# EAGLE design FireFly (EAGLE 9.5.2)
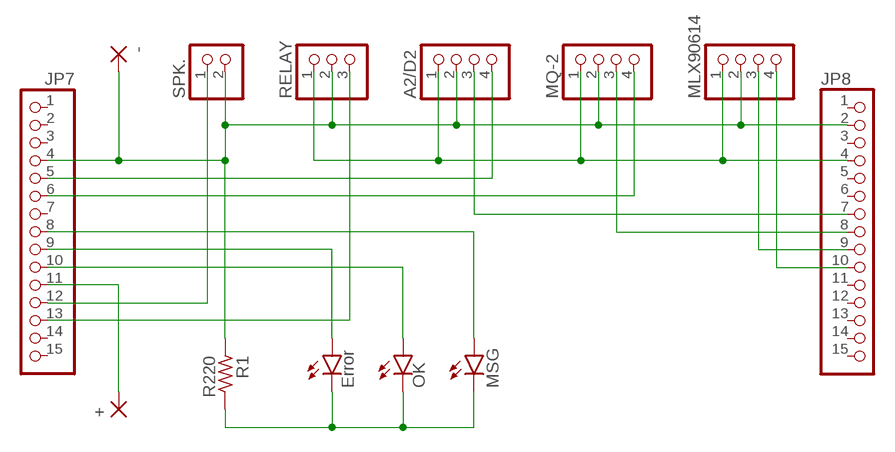
[diagram p0: schematic, sheet 1]

## Parts
+  WIREPADSMD1,27-254  [SMD1,27-2,54]
-  WIREPADSMD1,27-254  [SMD1,27-2,54]
A2/D2  PINHD-1X4  [1X04]
JP7  PINHD-1X15  [1X15]
JP8  PINHD-1X15  [1X15]
LED2  OK  LEDCHIPLED_0603  [CHIPLED_0603]
LED3  Error  LEDCHIPLED_0603  [CHIPLED_0603]
MLX90614  PINHD-1X4  [1X04]
MQ-2  PINHD-1X4  [1X04]
MSG  LEDCHIPLED_0603  [CHIPLED_0603]
R1  R220  R_0603  [R0603]
RELAY  PINHD-1X3  [1X03]
SPK.  PINHD-1X2  [1X02]

## Nets
N$1: JP8.10 MLX90614.4
N$2: JP8.9 MLX90614.3
N$3: JP8.8 MQ-2.3
N$4: JP7.6 MQ-2.4
N$5: A2/D2.3 JP8.7
N$6: -.1(P) A2/D2.2 JP7.4 JP8.2 MLX90614.2 MQ-2.2 R1.1 RELAY.2 SPK..2
N$7: A2/D2.4 JP7.5
N$8: JP7.13 RELAY.3
N$9: JP7.12 SPK..1
N$10: +.1(P) JP7.11
N$11: JP7.10 LED2.A
N$12: JP7.9 LED3.A
N$13: JP7.8 MSG.A
N$14: LED2.C LED3.C MSG.C R1.2
N$15: A2/D2.1 JP8.4 MLX90614.1 MQ-2.1 RELAY.1
Unconnected: JP7.1 JP7.2 JP7.3 JP7.7 JP7.14 JP7.15 JP8.1 JP8.3 JP8.5 JP8.6 JP8.11 JP8.12 JP8.13 JP8.14 JP8.15

## Library data of the parts
+ - = wirepad:WIREPAD: Wire PAD connect wire on PCB
A2/D2 MLX90614 MQ-2 = pinhead:PINHD-1X4: PIN HEADER
JP7 JP8 = pinhead:PINHD-1X15: PIN HEADER
LED2 LED3 MSG = led:LED: LED OSRAM: - CHIPLED LG R971, LG N971, LY N971, LG Q971, LY Q971, LO R971, LY R971 LH N974, LH R974 LS Q976, LO Q976, LY Q976 LO Q996 - Hyper CHIPLED LW Q18S LB Q993, LB Q99A, LB R99A - SideLED LS A670, LO A670, LY A670, LG A670, LP A670 LB A673, LV A673, LT A673, LW A673 LH A674 LY A675 LS A676, LA A676, LO A676, LY A676, LW A676 LS A679, LY A679, LG A679 - Hyper Micro SIDELED® LS Y876, LA Y876, LO Y876, LY Y876 LT Y87S - SmartLED LW L88C, LW L88S LB L89C, LB L89S, LG L890 LS L89K, LO L89K, LY L89K LS L896, LA L896, LO L896, LY L896 - TOPLED LS T670, LO T670, LY T670, LG T670, LP T670 LSG T670, LSP T670, LSY T670, LOP T670, LYG T670 LG T671, LOG T671, LSG T671 LB T673, LV T673, LT T673, LW T673 LH T674 LS T676, LA T676, LO T676, LY T676, LB T676, LH T676, LSB T676, LW T676 LB T67C, LV T67C, LT T67C, LS T67K, LO T67K, LY T67K, LW E67C LS E67B, LA E67B, LO E67B, LY E67B, LB E67C, LV E67C, LT E67C LW T67C LS T679, LY T679, LG T679 LS T770, LO T770, LY T770, LG T770, LP T770 LB T773, LV T773, LT T773, LW T773 LH T774 LS E675, LA E675, LY E675, LS T675 LS T776, LA T776, LO T776, LY T776, LB T776 LHGB T686 LT T68C, LB T68C - Hyper Mini TOPLED® LB M676 - Mini TOPLED Santana® LG M470 LS M47K, LO M47K, LY M47K Source: http://www.osram.convergy.de LUXEON: - LUMILED® LXK2-PW12-R00, LXK2-PW12-S00, LXK2-PW14-U00, LXK2-PW14-V00 LXK2-PM12-R00, LXK2-PM12-S00, LXK2-PM14-U00 LXK2-PE12-Q00, LXK2-PE12-R00, LXK2-PE12-S00, LXK2-PE14-T00, LXK2-PE14-U00 LXK2-PB12-K00, LXK2-PB12-L00, LXK2-PB12-M00, LXK2-PB14-N00, LXK2-PB14-P00, LXK2-PB14-Q00 LXK2-PR12-L00, LXK2-PR12-M00, LXK2-PR14-Q00, LXK2-PR14-R00 LXK2-PD12-Q00, LXK2-PD12-R00, LXK2-PD12-S00 LXK2-PH12-R00, LXK2-PH12-S00 LXK2-PL12-P00, LXK2-PL12-Q00, LXK2-PL12-R00 Source: www.luxeon.com KINGBRIGHT: KA-3528ASYC Source: www.kingbright.com
R1 = rc-master-smd:R_: RESISTOR
RELAY = pinhead:PINHD-1X3: PIN HEADER
SPK. = pinhead:PINHD-1X2: PIN HEADER

## Board
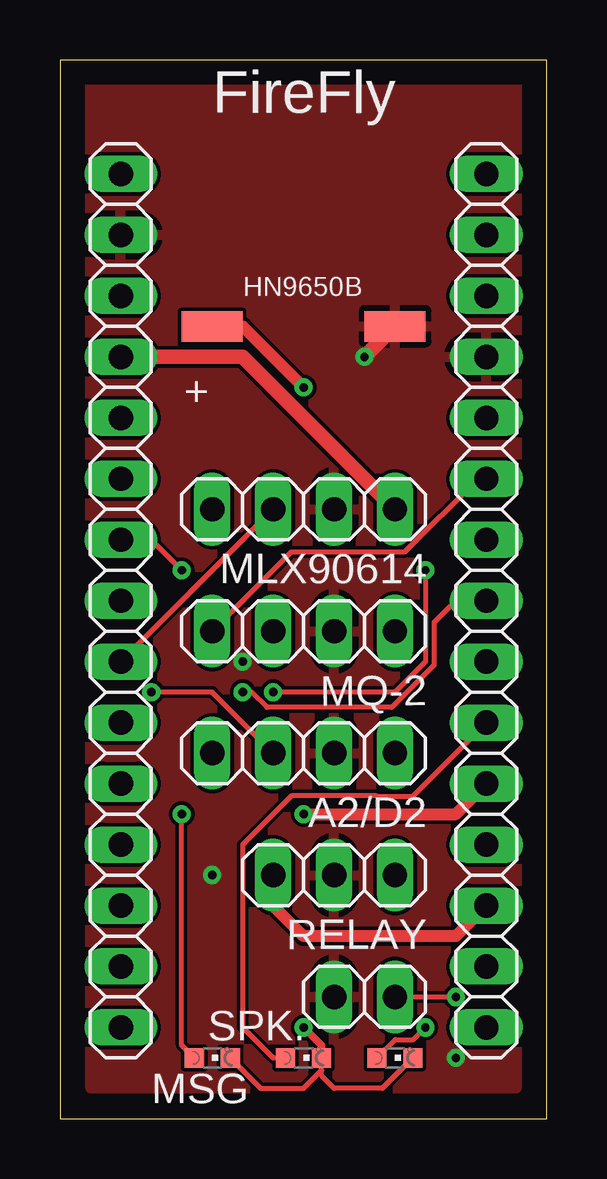
[diagram p1: board, top side]
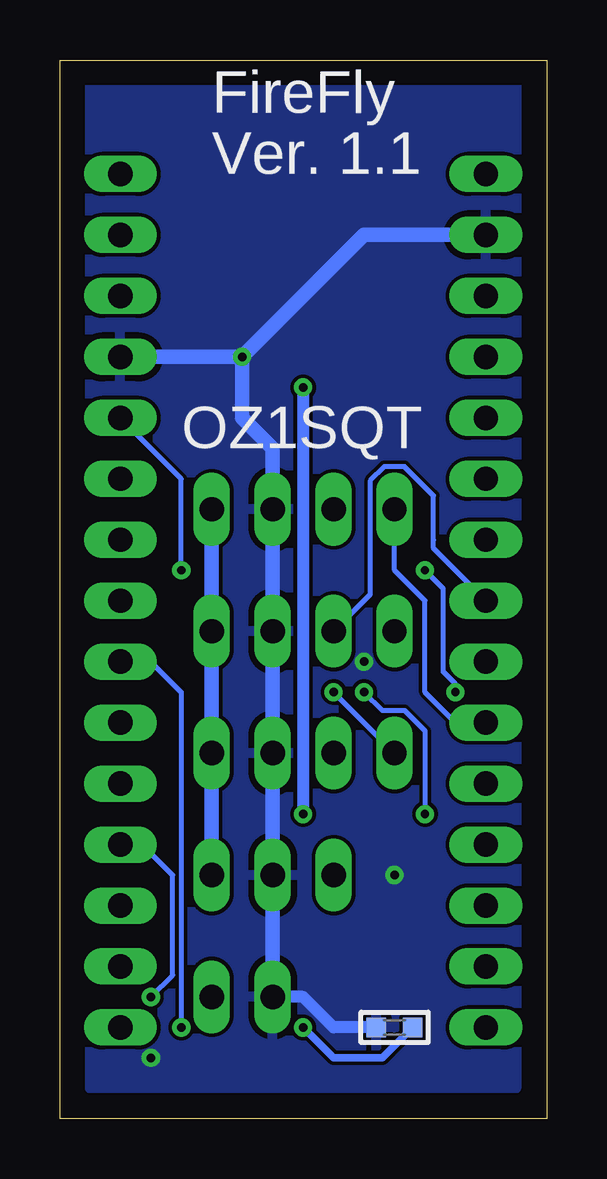
[diagram p2: board, bottom side, seen from below]

Size 20.3 x 44.12 mm. Coordinates in mm from the lower left corner, seen from the top.
Outline: 0,0 20.3,0 20.3,44.12 0,44.12 0,0
Copper layers (1*16): Top 0.035mm / dielectric 1.5mm / Bottom 0.035mm
Design rules "default": minimum track width 6mil, minimum drill 0.35mm, track to track 6mil, track to pad 6mil, pad to pad 6mil, via to via 6mil, smd to smd 6mil, copper to edge 40mil, drill to drill 6mil, minimum pad ring 10mil, minimum via ring 8mil, stop-mask expansion 4mil, vias tented up to drill 0mil, thermal gap 10mil

### Footprints (pad centres in the part's own frame; a part is rotated, then mirrored left to right if it is on the bottom)
SMD1,27-2,54 = smd 1.27 x 2.54: 1 0,0
1X04 = drill 1.016 long: 1 -3.81,0; 2 -1.27,0; 3 1.27,0; 4 3.81,0
1X15 = drill 1.016 long: 1 -17.78,0; 2 -15.24,0; 3 -12.7,0; 4 -10.16,0; 5 -7.62,0; 6 -5.08,0; 7 -2.54,0; 8 0,0; 9 2.54,0; 10 5.08,0; 11 7.62,0; 12 10.16,0; 13 12.7,0; 14 15.24,0; 15 17.78,0
CHIPLED_0603 = smd 0.8 x 0.8: A 0,-0.75; C 0,0.75
R0603 = smd 0.8 x 0.8: 1 -0.762,0; 2 0.762,0
1X03 = drill 1.016 long: 1 -2.54,0; 2 0,0; 3 2.54,0
1X02 = drill 1.016 long: 1 -1.27,0; 2 1.27,0

### Placement (x,y rotation side)
+  6.35,33.02 90 top
-  13.97,33.02 90 top
A2/D2  10.16,15.24 180 top
JP7  17.78,21.59 270 top
JP8  2.54,21.59 270 top
LED2  10.16,2.54 270 top
LED3  13.97,2.54 270 top
MLX90614  10.16,25.4 180 top
MQ-2  10.16,20.32 180 top
MSG  6.35,2.54 270 top
R1  6.35,3.81 0 bottom
RELAY  11.43,10.16 180 top
SPK.  12.7,5.08 180 top

### Tracks (layer width: path | path; a pad name or v marks a point on that pad's centre or on a via)
N$1
  Bottom 0.203: JP8.10 3.81,16.51 5.08,17.78 5.08,21.59 6.35,22.86 MLX90614.4
N$2
  Top 0.203: JP8.9 MLX90614.3
N$3
  Bottom 0.203: JP8.8 4.72,23.77 4.72,24.13 4.72,25.97 5.93,27.18 6.77,27.18 7.37,26.58 7.37,21.84 MQ-2.3
N$4
  Top 0.203: MQ-2.4 9.65,23.62 14.39,23.62 17.44,26.67 JP7.6
N$5  (via drill 0.35)
  Top 0.203: A2/D2.3 6.35,17.78 v3.81,17.78 | JP8.7 3.81,24.13 v5.08,22.86
  Bottom 0.203: v3.81,17.78 3.81,18.12 4.32,18.63 4.32,22.1 v5.08,22.86
N$6  (via drill 0.35)
  Top 0.61: v12.7,31.75 -.1
  Bottom 0.508: R1.1 8.89,3.81 10.16,5.08 SPK..2
  Bottom 0.61: SPK..2 RELAY.2 A2/D2.2 MQ-2.2 MLX90614.2 11.43,27.94 12.7,29.21 v12.7,31.75 | JP7.4 v12.7,31.75 | JP8.2 7.62,36.83 v12.7,31.75
  other vias: 6.35,10.16 16.51,2.54 7.62,19.05
  pour Top: 1.27,43.18 19.05,43.18 19.05,1.27 1.27,1.27
  pour Bottom: 1.27,43.18 1.27,1.27 19.05,1.27 19.05,43.18
  pour Top: 1.27,43.18 1.27,1.27 19.05,1.27 19.05,43.18
N$7  (via drill 0.35)
  Top 0.203: v15.24,22.86 15.24,19.05 13.97,17.78 v8.89,17.78
  Bottom 0.203: v15.24,22.86 15.24,26.67 JP7.5 | A2/D2.4 v8.89,17.78
N$8
  Top 0.508: JP7.13 16.51,7.62 10.16,7.62 8.89,8.89 RELAY.3
N$9  (via drill 0.35)
  Top 0.203: SPK..1 v16.51,5.08
  Bottom 0.203: 16.85,11.43 JP7.12 16.87,11.43 15.6,10.16 15.6,5.99 v16.51,5.08
N$10  (via drill 0.35)
  Top 0.508: +.1 7.62,33.02 v10.16,30.48 | JP7.11 16.51,12.7 v10.16,12.7
  Bottom 0.508: v10.16,30.48 v10.16,12.7
N$11
  Top 0.203: LED2.A 8.89,2.54 7.62,3.81 7.62,11.43 9.65,13.46 13.21,13.46 13.22,13.45 14.72,13.45 JP7.10
N$12  (via drill 0.35)
  Top 0.203: LED3.A 13.98,3.3 14.73,3.3 v15.24,3.81
  Bottom 0.203: JP7.9 16.51,19.05 15.24,17.78 v15.24,3.81
N$13  (via drill 0.35)
  Top 0.203: JP7.8 16.51,21.59 15.6,20.68 15.6,18.9 13.84,17.15 8.63,17.15 8,17.78 v7.62,17.78 | MSG.A 5.08,3.06 v5.08,12.7
  Bottom 0.203: v7.62,17.78 6.86,17.02 5.93,17.02 5.08,16.17 v5.08,12.7
N$14  (via drill 0.35)
  Top 0.203: LED3.C 13.45,1.27 11.43,1.27 10.91,1.79 LED2.C 10.91,2.02 10.16,1.27 8.37,1.27 MSG.C
  Top 0.305: v10.16,3.81 10.91,3.06 LED2.C
  Bottom 0.305: R1.2 6.86,2.54 8.89,2.54 v10.16,3.81
N$15
  Top 0.61: JP8.4 7.62,31.75 MLX90614.1
  Bottom 0.61: RELAY.1 A2/D2.1 MQ-2.1 MLX90614.1

### Text on the board
tPlace: FireFly | HN9650B
bPlace: FireFly | Ver. 1.1 | OZ1SQT